# Altium schematic sheet Driver1.SchDoc
size A4; SheetNumber: 1; SheetTotal: 1
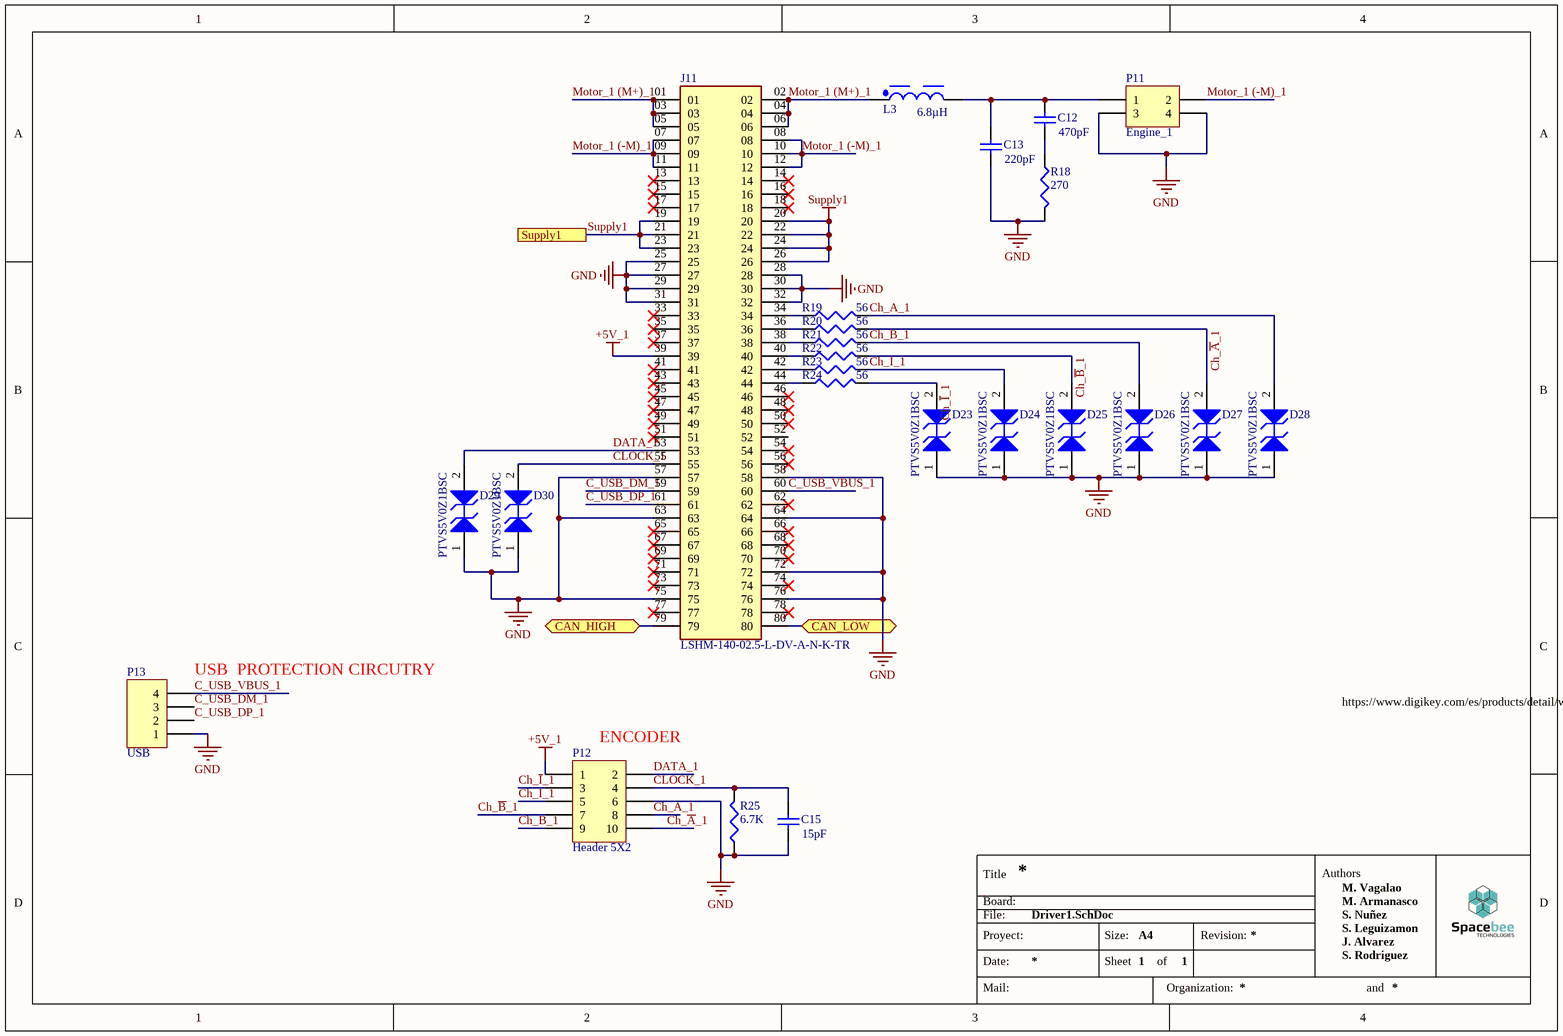
[diagram p0: Driver1.SchDoc]

## Parts
C12  value 470pF  [1608[0603]]  (hidden comment: Cap Semi)
C13  value 220pF  [1608[0603]]  (hidden comment: Cap Semi)
C15  value 15pF  [1608[0603]]  (hidden comment: Cap Semi)
D23  PTVS5V0Z1BSC  [SOD993B]
D24  PTVS5V0Z1BSC  [SOD993B]
D25  PTVS5V0Z1BSC  [SOD993B]
D26  PTVS5V0Z1BSC  [SOD993B]
D27  PTVS5V0Z1BSC  [SOD993B]
D28  PTVS5V0Z1BSC  [SOD993B]
D29  PTVS5V0Z1BSC  [SOD993B]
D30  PTVS5V0Z1BSC  [SOD993B]
J11  LSHM-140-02.5-L-DV-A-N-K-TR  [SAMTEC_LSHM-140-02.5-L-DV-A-N-K-TR]
L3  6.8µH  [WE-XHMA_6060]
P11  Engine_1  [MOLEX_1724480004]
P12  Header 5X2  [CONN_HIF3FC-14PA-2.54DS(71)_HIR]
P13  USB  [HDR1X4]
R18  value 270  [J1-0603]  (hidden comment: Res3)
R19  value 56  [J1-0603]  (hidden comment: Res3)
R20  value 56  [J1-0603]  (hidden comment: Res3)
R21  value 56  [J1-0603]  (hidden comment: Res3)
R22  value 56  [J1-0603]  (hidden comment: Res3)
R23  value 56  [J1-0603]  (hidden comment: Res3)
R24  value 56  [J1-0603]  (hidden comment: Res3)
R25  value 6.7K  [J1-0603]  (hidden comment: Res3)

## Ports
CAN_HIGH (bidir), CAN_LOW (bidir), Supply1

## Nets
+5V_1: J11.39 P12.1
GND: C13.2 C15.2 D23.1(A1) D24.1(A1) D25.1(A1) D26.1(A1) D27.1(A1) D28.1(A1) D29.1(A1) D30.1(A1) J11.25 J11.27 J11.28 J11.29 J11.30 J11.31 J11.32 J11.57 J11.58 J11.63 J11.64 J11.72 J11.75 J11.76 P11.3 P11.4 P12.6 P13.1 R18.2 R25.1
Supply1: J11.19 J11.20 J11.21 J11.22 J11.23 J11.24 J11.26 ; port Supply1
C_USB_DM_1: J11.59 P13.3
C_USB_DP_1: J11.61 P13.2
C_USB_VBUS_1: J11.60 P13.4
CAN_HIGH: J11.79 ; port CAN_HIGH
CAN_LOW: J11.80 ; port CAN_LOW
Ch_~{A}_1: D27.2(A2) P12.10 R20.2
Ch_A_1: D28.2(A2) P12.8 R19.2
Ch_~{B}_1: D25.2(A2) P12.7 R22.2
Ch_B_1: D26.2(A2) P12.9 R21.2
Ch_~{I}_1: D23.2(A2) P12.3 R24.2
Ch_I_1: D24.2(A2) P12.5 R23.2
CLOCK_1: C15.1 D30.2(A2) J11.55 P12.4 R25.2
DATA_1: D29.2(A2) J11.53 P12.2
Motor_1 (-M)_1: J11.07 J11.08 J11.09 J11.10 J11.11 J11.12 P11.2
Motor_1 (M+)_1: J11.01 J11.02 J11.03 J11.04 J11.05 J11.06 L3.1
NetC12_1: C12.1 C13.1 L3.2 P11.1
NetC12_2: C12.2 R18.1
NetJ11_34: J11.34 R19.1
NetJ11_36: J11.36 R20.1
NetJ11_38: J11.38 R21.1
NetJ11_40: J11.40 R22.1
NetJ11_42: J11.42 R23.1
NetJ11_44: J11.44 R24.1

Not connected (* = marked no-connect by the designer): J11 13* 14* 15* 16* 17* 18* 33* 35* 37* 41* 43* 45* 46* 47* 48* 49* 50* 51* 52 54* 56* 62* 65* 66* 67* 68* 69* 70* 71* 73* 74* 77* 78*

## Notes on the sheet
- (near P13) USB  PROTECTION CIRCUTRY
- (near P12) ENCODER
- https://www.digikey.com/es/products/detail/würth-elektronik/9774050243R/5320640?s=N4IgTCBcDaIJwHYEBYAMBWVZkGYBKIAugL5A
- Title
- Board:
- File:
- Authors
- M. Armanasco
- S. Nuñez
- M. Vagalao
- Proyect:
- Date:
- Mail:
- Size:
- Sheet
- A4
- of
- Organization:
- Revision:
- S. Rodriguez
- S. Leguizamon
- J. Alvarez
- and

## Library data of the parts
C12 C13 C15 = Cap Semi: Capacitor (Semiconductor SIM Model); Published: 8-Jun-2000; LatestRevisionDate: 29-May-2009; LatestRevisionNote: IPC-7351 Footprint Added.; PackageReference: C1206; Publisher: Altium Limited; PackageDescription: Chip Capacitor
D23-D30 = PTVS5V0Z1BSC: Manufacturer: On Semiconductor; PartNumber: 1SMB16CAT3; Direction: Bidirectional; IR Max (uA): 5; Packing: Tape and Reel; PPK Max (W): 600; V(BR) Typ (V): 18.74; DatasheetVersion: Rev. A; PackageVersion: Rev. A, 01/2000; PackageReference: SMB-2-403C-01; PackageDescription: 2-Pin Small Molded Package, J-Bend Lead, Body 4.315 x 3.555 mm; Supplier 1: Digi-Key; Supplier Part Number 1: 1SMB16CAT3OSTR-ND; Supplier 2: Digi-Key; Supplier Part Number 2: 1SMB16CAT3OSCT-ND; Supplier 3: Digi-Key; Supplier Part Number 3: 1SMB16CAT3OSDKR-ND; Mounting Technology: Surface Mount; ComponentLink1Description: Manufacturer URL; ComponentLink1URL: http://www.onsemi.com/; ComponentLink2Description: Datasheet; ComponentLink2URL: http://www.onsemi.com/pub_link/Collateral/1SMB10CAT3-D.PDF; ComponentLink3Description: Package Specification; ComponentLink3URL: http://www.onsemi.com/pub_link/Collateral/1SMB10CAT3-D.PDF
J11 = LSHM-140-02.5-L-DV-A-N-K-TR: LSHM - Samtec 0.50mm Razor Beam High-Speed Hermaphroditic Terminal / Socket Strip.; Price: None; MP: LSHM-140-02.5-L-DV-A-N-K-TR; Availability: Unavailable; Value: *; Package: None
L3 = 78439369068: WE-XHMA SMD Power Inductor, size 1090, 6.8µH, 10.5A, 7.16mΩ; Manufacturer: Wurth Elektronik; Case/Size Code: 1090; Inductance Tolerance: 20%; Saturation Current: 23.25A; Self Resonant Frequency: 16MHz; ComponentLink1Description: Website Link; ComponentLink1URL: https://www.we-online.com/redexpert/article/78439369068?ad; ComponentLink2Description: Datasheet Link; ComponentLink2URL: https://www.we-online.com/redexpert/spec/78439369068?ad; Manufacturer Part Number: 78439369068; Category: Shielded Power Inductors; Match Code: WE-XHMA; Mount: Surface Mount; Operating Temperature Max: 125°C; Operating Temperature Min: -40°C; Packaging: Tape and Reel; Length: 11.6mm; Width: 10.5mm; Height: 8.8mm; DC Resistance: 7.16mΩ; Inductance: 6.8µH; Rated Current: 10.5A
P11 = Header 2X2: Header, 2-Pin, Dual row; LatestRevisionDate: 17-Jul-2002; LatestRevisionNote: Re-released for DXP Platform.; Publisher: Altium Limited
P12 = Header 5X2: Header, 5-Pin, Dual row; LatestRevisionDate: 17-Jul-2002; LatestRevisionNote: Re-released for DXP Platform.; Publisher: Altium Limited
P13 = Header 4: Header, 4-Pin; LatestRevisionDate: 17-Jul-2002; LatestRevisionNote: Re-released for DXP Platform.; Publisher: Altium Limited
R18-R25 = Res3: Resistor; Published: 8-Jun-2000; LatestRevisionDate: 29-May-2009; LatestRevisionNote: IPC-7351 Footprint Added.; PackageReference: J1-0603; Publisher: Altium Limited; PackageDescription: Chip Resistor